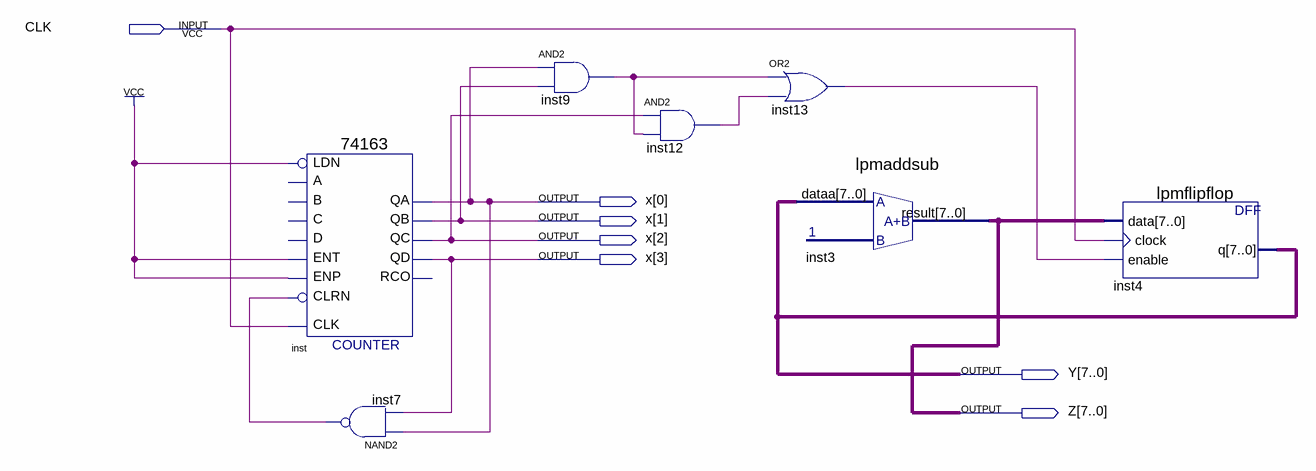
[diagram p0: schematic sheet]
// Quartus schematic AdderWith74163.bdf as structural Verilog: 7 symbols, 7 pins
module AdderWith74163 (
  input  CLK,
  output [3:0] x,
  output [7:0] Y,
  output [7:0] Z
);

  wire inst7_out, inst9_out, inst12_out, inst13_out;

  \74163  inst (
    .ENT(1'b1), .CLRN(inst7_out), .CLK(CLK), .ENP(1'b1), .LDN(1'b1), .QA(x[0]), .QB(x[1]), .QC(x[2]),
    .QD(x[3]));  // open: C, B, A, D, RCO
  nand inst7 (inst7_out, x[0], x[3]);
  and inst9 (inst9_out, x[0], x[1]);
  and inst12 (inst12_out, x[2], inst9_out);
  or inst13 (inst13_out, inst9_out, inst12_out);
  lpmaddsub inst3 (.dataa(Y), .result(Z));
  lpmflipflop inst4 (.data(Z), .clock(CLK), .enable(inst13_out), .q(Y));
endmodule
